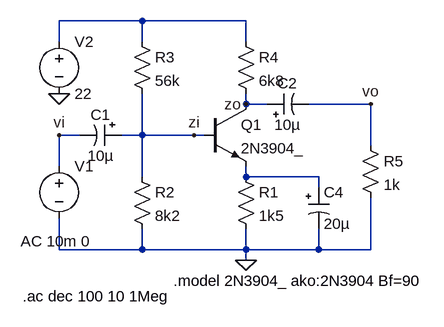
[diagram p0: schematic impedancia-entrada-salida.asc]
impedancia-entrada-salida.asc, the LTspice schematic file:
Version 4
SHEET 1 880 680
WIRE 64 16 -64 16
WIRE 224 16 64 16
WIRE -64 48 -64 16
WIRE 64 48 64 16
WIRE 224 48 224 16
WIRE 224 144 224 128
WIRE 256 144 224 144
WIRE 416 144 320 144
WIRE -32 192 -64 192
WIRE 64 192 64 128
WIRE 64 192 32 192
WIRE 144 192 64 192
WIRE 160 192 144 192
WIRE 416 208 416 144
WIRE -64 240 -64 192
WIRE 64 256 64 192
WIRE 224 256 224 240
WIRE 336 256 224 256
WIRE 336 272 336 256
WIRE -64 368 -64 320
WIRE 64 368 64 336
WIRE 64 368 -64 368
WIRE 224 368 224 336
WIRE 224 368 64 368
WIRE 336 368 336 336
WIRE 336 368 224 368
WIRE 416 368 416 288
WIRE 416 368 336 368
WIRE 224 384 224 368
FLAG 224 384 0
FLAG -64 128 0
FLAG -64 192 vi
FLAG 416 144 vo
FLAG 144 192 zi
FLAG 224 144 zo
SYMBOL npn 160 144 R0
SYMATTR InstName Q1
SYMATTR Value 2N3904_
SYMBOL res 208 240 R0
SYMATTR InstName R1
SYMATTR Value 1k5
SYMBOL res 48 240 R0
SYMATTR InstName R2
SYMATTR Value 8k2
SYMBOL res 48 32 R0
SYMATTR InstName R3
SYMATTR Value 56k
SYMBOL res 208 32 R0
SYMATTR InstName R4
SYMATTR Value 6k8
SYMBOL voltage -64 224 R0
WINDOW 3 -59 103 Left 2
WINDOW 123 -59 131 Left 2
WINDOW 39 0 0 Left 0
SYMATTR InstName V1
SYMATTR Value ""
SYMATTR Value2 AC 10m 0
SYMBOL voltage -64 32 R0
SYMATTR InstName V2
SYMATTR Value 22
SYMBOL res 400 192 R0
SYMATTR InstName R5
SYMATTR Value 1k
SYMBOL polcap 320 272 R0
SYMATTR InstName C4
SYMATTR Value 20µ
SYMBOL polcap 32 176 R90
WINDOW 0 0 32 VBottom 2
WINDOW 3 32 32 VTop 2
SYMATTR InstName C1
SYMATTR Value 10µ
SYMBOL polcap 256 160 R270
WINDOW 0 32 32 VTop 2
WINDOW 3 0 32 VBottom 2
SYMATTR InstName C2
SYMATTR Value 10µ
TEXT 112 416 Left 2 !.model 2N3904_ ako:2N3904 Bf=90
TEXT -120 440 Left 2 !.ac dec 100 10 1Meg

The netlist it stands for:
* impedancia-entrada-salida.asc
Q1 zo zi N002 0 2N3904_
R1 N002 0 1k5
R2 zi 0 8k2
R3 N001 zi 56k
R4 N001 zo 6k8
V1 vi 0 AC 10m 0
V2 N001 0 22
R5 vo 0 1k
C4 N002 0 20µ
C1 zi vi 10µ
C2 zo vo 10µ
.model NPN NPN
.model PNP PNP
.lib standard.bjt
.model 2N3904_ ako:2N3904 Bf=90
.ac dec 100 10 1Meg
.backanno
.end